# Altium schematic sheet Remote_Core.SchDoc
size A3; Organization: Altium Limited; Address1: L3, 12a Rodborough Rd; Address2: Frenchs Forest; Address3: NSW; Address4: Australia 2086
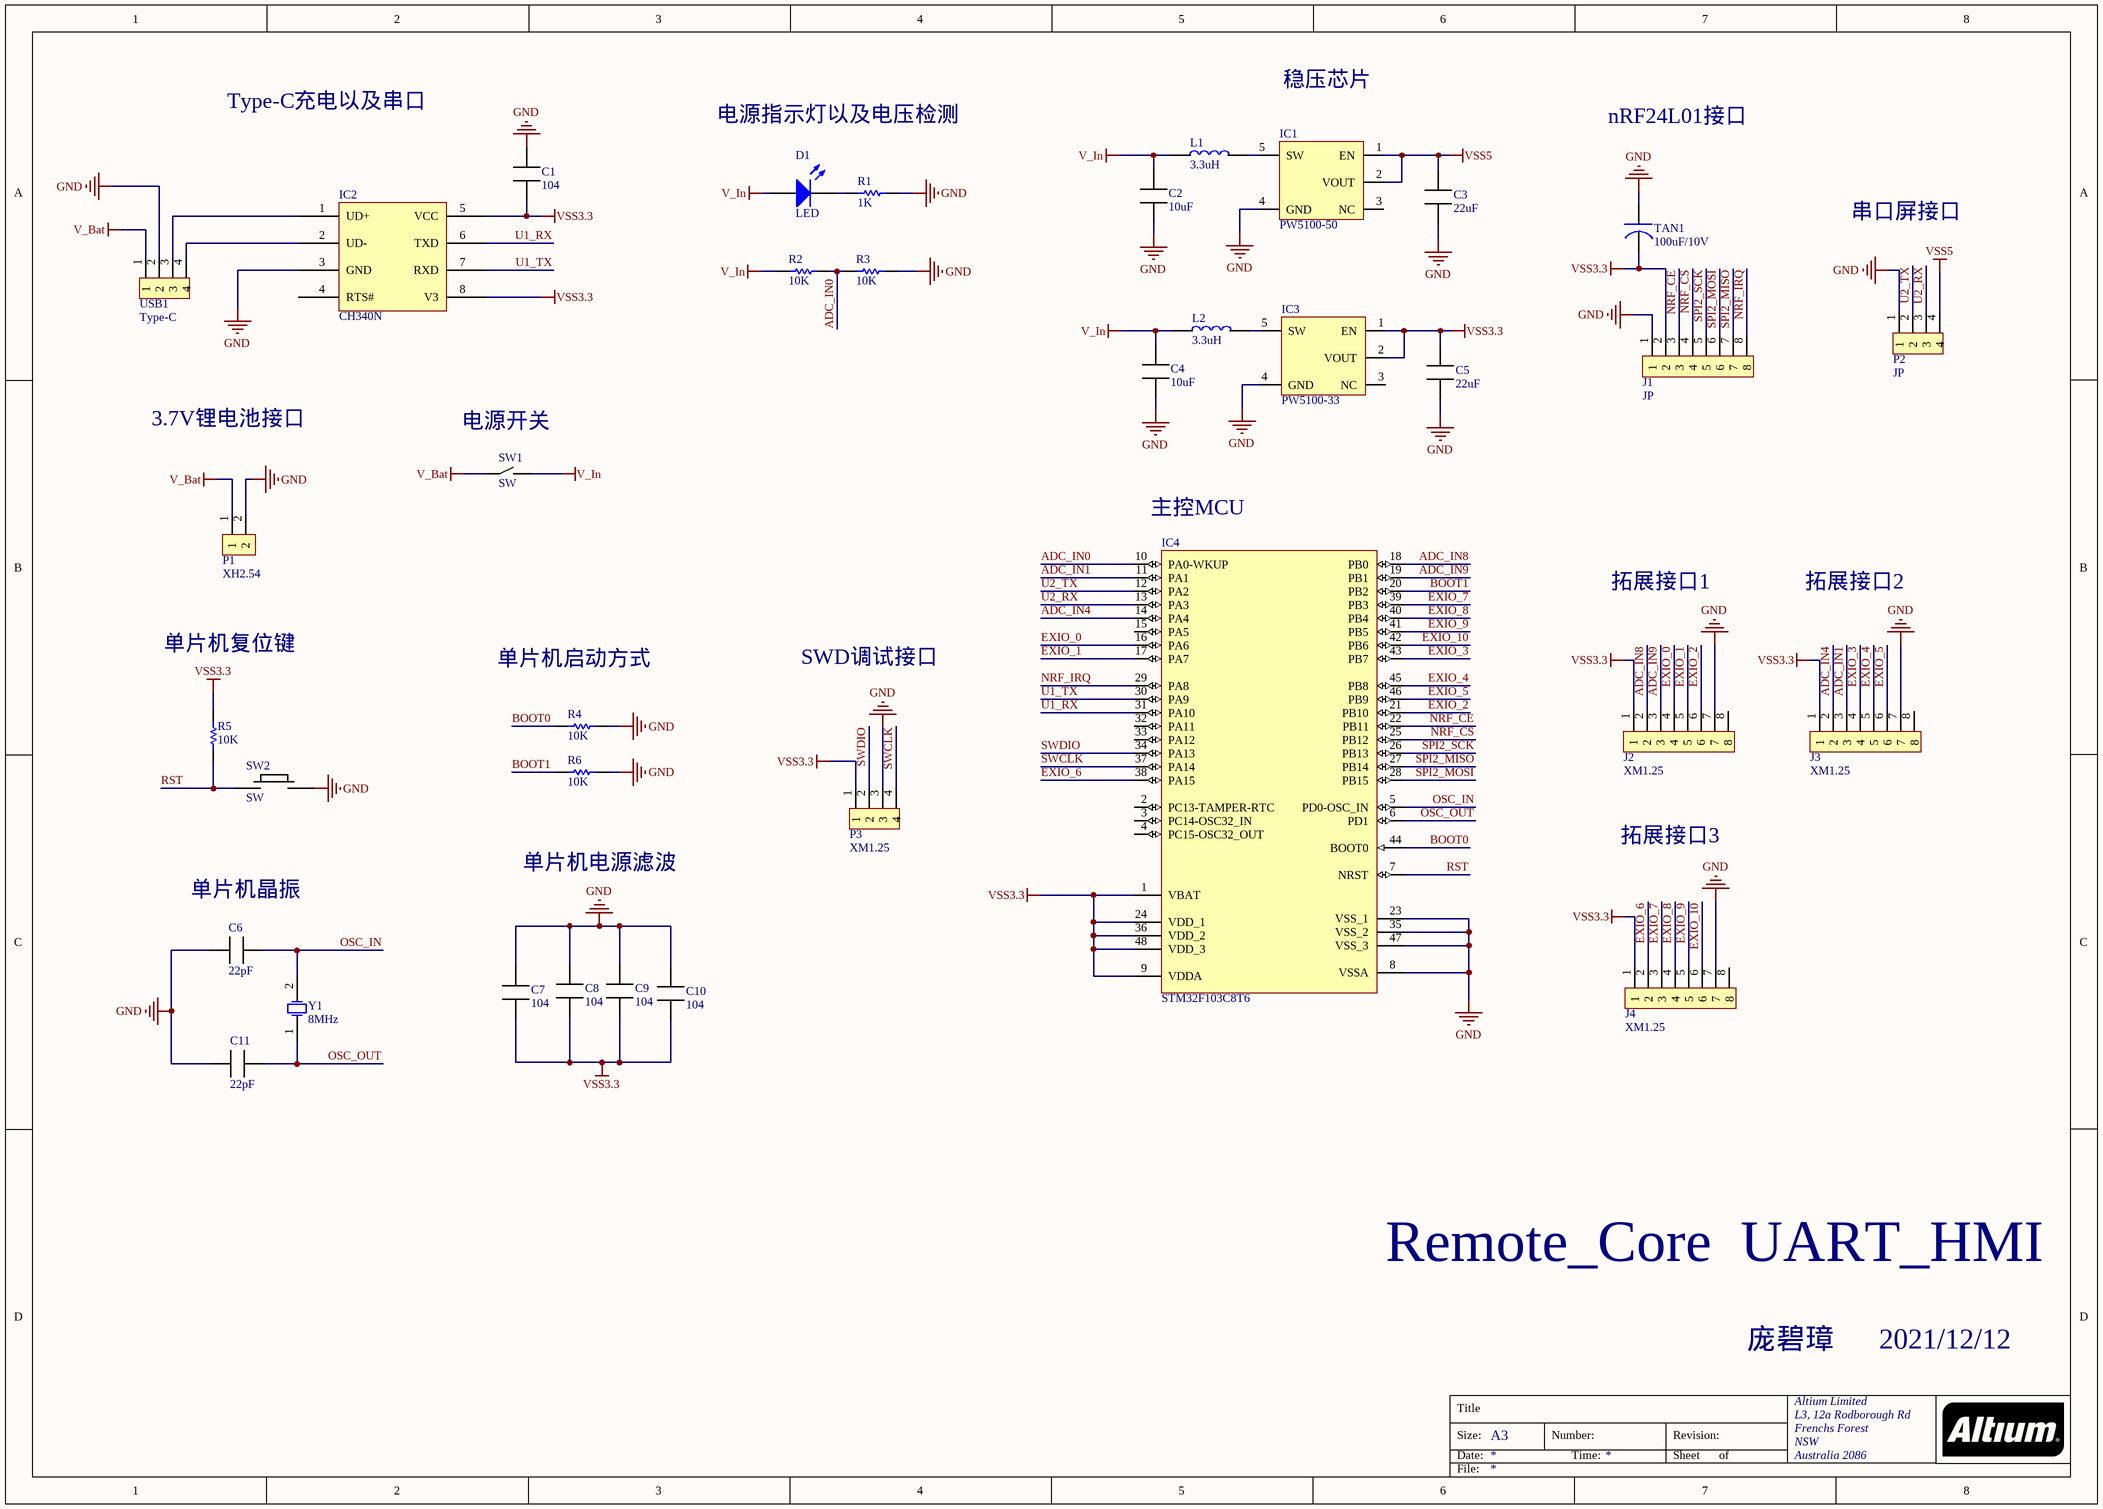
[diagram p0: Remote_Core.SchDoc]

## Parts
C1  104  [C 0603]
C2  10uF  [C 0603]
C3  22uF  [C 0603]
C4  10uF  [C 0603]
C5  22uF  [C 0603]
C6  22pF  [C 0603]
C7  104  [C 0603]
C8  104  [C 0603]
C9  104  [C 0603]
C10  104  [C 0603]
C11  22pF  [C 0603]
D1  LED  [LED 0603]
IC1  PW5100-50  [PW5100]
IC2  CH340N  [SOP-8]
IC3  PW5100-33  [PW5100]
IC4  STM32F103C8T6  [LQPF48 7X7]
J1  JP  [HDR2.54-LI-2x4P]
J2  XM1.25  [MX1.25 8P]
J3  XM1.25  [MX1.25 8P]
J4  XM1.25  [MX1.25 8P]
L1  3.3uH  [0630]
L2  3.3uH  [0630]
P1  XH2.54  [XH2.54 2P]
P2  JP  [2.54 _ 4Pin]
P3  XM1.25  [MX1.25]
R1  1K  [R 0603]
R2  10K  [R 0603]
R3  10K  [R 0603]
R4  10K  [R 0603]
R5  10K  [R 0603]
R6  10K  [R 0603]
SW1  SW  [拨动开关 9X3.5X3.5 侧卧]
SW2  SW  [SW SMD 3x6x2.5]
TAN1  100uF/10V  [6.3*5.4mm 电解电容]
USB1  Type-C  [USB Type-C]
Y1  8MHz  [OSC SMD]

## Nets
GND: C1.2 C2.1 C3.1 C4.1 C5.1 C6.1 C7.2 C8.2 C9.2 C10.2 C11.1 IC1.4(GND) IC2.3(GND) IC3.4(GND) IC4.8(VSSA) IC4.23(VSS_1) IC4.35(VSS_2) IC4.47(VSS_3) J1.1 J2.7 J3.7 J4.7 P1.2 P2.1 P3.3 R1.2 R3.2 R4.2 R6.2 SW2.2 TAN1.2 USB1.2
V_Bat: P1.1 SW1.2 USB1.1
V_In: C2.2 C4.2 D1.1(A) L1.1 L2.1 R2.1 SW1.1
VSS3.3: C1.1 C5.2 C7.1 C8.1 C9.1 C10.1 IC2.5(VCC) IC2.8(V3) IC3.1(EN) IC3.2(VOUT) IC4.1(VBAT) IC4.9(VDDA) IC4.24(VDD_1) IC4.36(VDD_2) IC4.48(VDD_3) J1.2 J2.1 J3.1 J4.1 P3.1 R5.2 TAN1.1
VSS5: C3.2 IC1.1(EN) IC1.2(VOUT) P2.4
ADC_IN0: IC4.10(PA0-WKUP) R2.2 R3.1
ADC_IN1: IC4.11(PA1) J3.3
ADC_IN4: IC4.14(PA4) J3.2
ADC_IN8: IC4.18(PB0) J2.2
ADC_IN9: IC4.19(PB1) J2.3
BOOT0: IC4.44(BOOT0) R4.1
BOOT1: IC4.20(PB2) R6.1
EXIO_0: IC4.16(PA6) J2.4
EXIO_1: IC4.17(PA7) J2.5
EXIO_2: IC4.21(PB10) J2.6
EXIO_3: IC4.43(PB7) J3.4
EXIO_4: IC4.45(PB8) J3.5
EXIO_5: IC4.46(PB9) J3.6
EXIO_6: IC4.38(PA15) J4.2
EXIO_7: IC4.39(PB3) J4.3
EXIO_8: IC4.40(PB4) J4.4
EXIO_9: IC4.41(PB5) J4.5
EXIO_10: IC4.42(PB6) J4.6
NRF_CE: IC4.22(PB11) J1.3
NRF_CS: IC4.25(PB12) J1.4
NRF_IRQ: IC4.29(PA8) J1.8
OSC_IN: C6.2 IC4.5(PD0-OSC_IN) Y1.2(OSC2)
OSC_OUT: C11.2 IC4.6(PD1) Y1.1(OSC1)
RST: IC4.7(NRST) R5.1 SW2.1
SPI2_MISO: IC4.27(PB14) J1.7
SPI2_MOSI: IC4.28(PB15) J1.6
SPI2_SCK: IC4.26(PB13) J1.5
SWCLK: IC4.37(PA14) P3.4
SWDIO: IC4.34(PA13) P3.2
U1_RX: IC2.6(TXD) IC4.31(PA10)
U1_TX: IC2.7(RXD) IC4.30(PA9)
U2_RX: IC4.13(PA3) P2.3
U2_TX: IC4.12(PA2) P2.2
NetD1_2: D1.2(K) R1.1
NetIC1_5: IC1.5(SW) L1.2
NetIC2_1: IC2.1(UD+) USB1.3
NetIC2_2: IC2.2(UD-) USB1.4
NetIC3_5: IC3.5(SW) L2.2

Not connected (* = marked no-connect by the designer): IC1 3(NC); IC2 4(RTS#); IC3 3(NC); IC4 2(PC13-TAMPER-RTC) 3(PC14-OSC32_IN) 4(PC15-OSC32_OUT) 15(PA5) 32(PA11) 33(PA12); J2 8; J3 8; J4 8

## Notes on the sheet
- Type-C充电以及串口
- 稳压芯片
- 电源指示灯以及电压检测
- nRF24L01接口
- 串口屏接口
- 3.7V锂电池接口
- (near SW1) 电源开关
- (near IC4) 主控MCU
- 单片机复位键
- 拓展接口1
- 拓展接口2
- 单片机启动方式
- SWD调试接口
- 拓展接口3
- (near C6) 单片机晶振
- 单片机电源滤波
- Remote_Core  UART_HMI
- 庞碧璋      2021/12/12
- Title
- Size:
- Date:
- A3
- Number:
- Time:
- Revision:
- Sheet
- of
- File:

## Library data of the parts
C1-C11 = 电容
D1 = LED: Typical INFRARED GaAs LED; Published: 8-Jun-2000; LatestRevisionDate: 08-Jul-2005; LatestRevisionNote: Mech Layer 1 removed.; PackageReference: LED-0; Publisher: Altium Limited; PackageDescription: LED; 2 Leads
IC1 IC3 = PW5100
J1-J4 = 1X8排针
L1 L2 = 电感
P1 = 1X2排针
P2 P3 = 1X4排针
R1-R6 = Res: Resistor; Published: 8-Jun-2000; LatestRevisionDate: 17-Jul-2002; LatestRevisionNote: Re-released for DXP Platform.; PackageReference: AXIAL-0.3; Publisher: Altium Limited; PackageDescription: Axial Device, Thru-Hole; 2 Leads; 0.3 in Pin Spacing
SW1 = 开关
SW2 = 弹簧开关
TAN1 = 极性电容
USB1 = 1X4排针: pin to pad: 3>A6 4>A7
Y1 = 晶振: Crystal Oscillator; Published: 8-Jun-2000; LatestRevisionDate: 17-Jul-2002; LatestRevisionNote: Re-released for DXP Platform.; PackageReference: R38; Publisher: Altium Limited; PackageDescription: Crystal, Thru-Hole; 2 Leads; Body 3.1 x 8.2 mm (Dia.xH)